# EAGLE design controller (EAGLE 9.6.2)
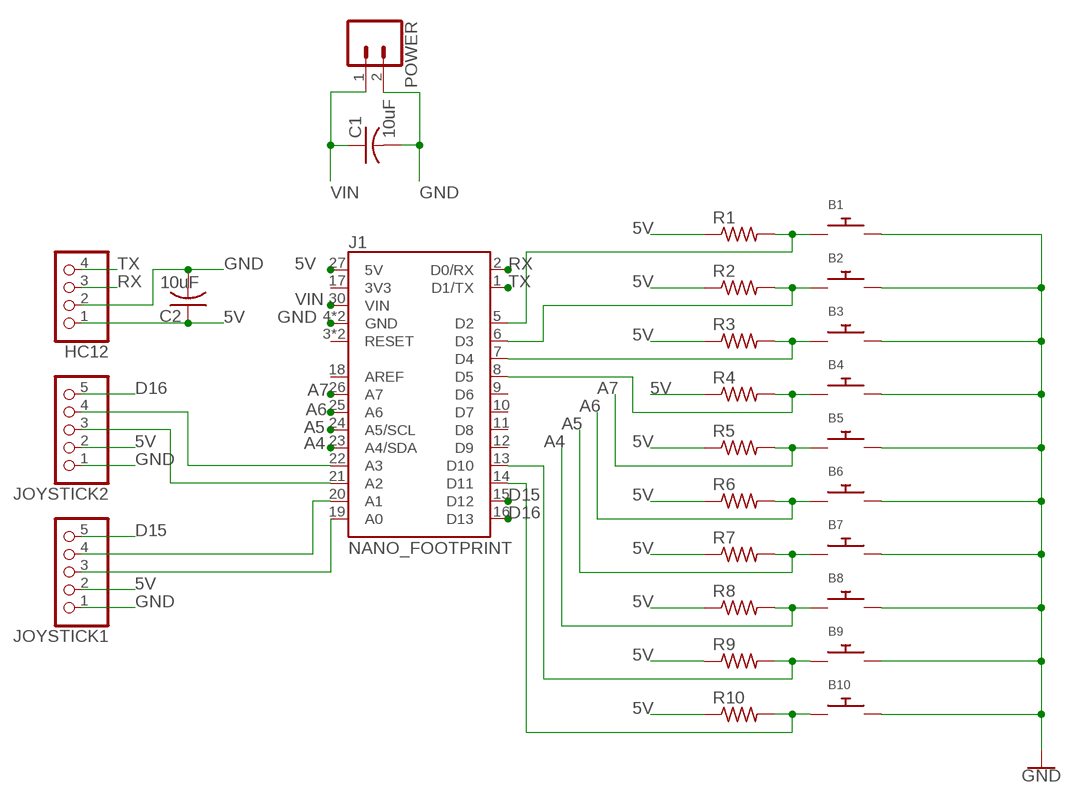
[diagram p0: schematic, sheet 1]

## Parts
B1  SWITCH_PUSHBUTTONEVQ-PE  [TACT_PANA-EVQ]
B2  SWITCH_PUSHBUTTONEVQ-PE  [TACT_PANA-EVQ]
B3  SWITCH_PUSHBUTTONEVQ-PE  [TACT_PANA-EVQ]
B4  SWITCH_PUSHBUTTONEVQ-PE  [TACT_PANA-EVQ]
B5  SWITCH_PUSHBUTTONEVQ-PE  [TACT_PANA-EVQ]
B6  SWITCH_PUSHBUTTONEVQ-PE  [TACT_PANA-EVQ]
B7  SWITCH_PUSHBUTTONEVQ-PE  [TACT_PANA-EVQ]
B8  SWITCH_PUSHBUTTONEVQ-PE  [TACT_PANA-EVQ]
B9  SWITCH_PUSHBUTTONEVQ-PE  [TACT_PANA-EVQ]
B10  SWITCH_PUSHBUTTONEVQ-PE  [TACT_PANA-EVQ]
C1  10uF  C-US025-024X044  [C025-024X044]
C2  10uF  C-US025-024X044  [C025-024X044]
HC12  PINHD-1X4  [1X04]
J1  NANO_FOOTPRINT  [NANO]
JOYSTICK1  PINHD-1X5  [1X05]
JOYSTICK2  PINHD-1X5  [1X05]
POWER  CONN_02  [1X02]
R1  R-US_0204/7  [0204/7]
R2  R-US_0204/7  [0204/7]
R3  R-US_0204/7  [0204/7]
R4  R-US_0204/7  [0204/7]
R5  R-US_0204/7  [0204/7]
R6  R-US_0204/7  [0204/7]
R7  R-US_0204/7  [0204/7]
R8  R-US_0204/7  [0204/7]
R9  R-US_0204/7  [0204/7]
R10  R-US_0204/7  [0204/7]

## Nets
5V: C2.1 HC12.1 J1.27(5V) JOYSTICK1.2 JOYSTICK2.2 R1.1 R2.1 R3.1 R4.1 R5.1 R6.1 R7.1 R8.1 R9.1 R10.1
A4: B8.P$1 J1.23(A4/SDA) R8.2
A5: B7.P$1 J1.24(A5/SCL) R7.2
A6: B6.P$1 J1.25(A6) R6.2
A7: B5.P$1 J1.26(A7) R5.2
D15: J1.15(D12) JOYSTICK1.5
D16: J1.16(D13) JOYSTICK2.5
GND: B1.P$2 B2.P$2 B3.P$2 B4.P$2 B5.P$2 B6.P$2 B7.P$2 B8.P$2 B9.P$2 B10.P$2 C1.2 C2.2 HC12.2 J1.4(GND) J1.29(GND) JOYSTICK1.1 JOYSTICK2.1 POWER.2
N$1: B1.P$1 J1.5(D2) R1.2
N$2: B2.P$1 J1.6(D3) R2.2
N$3: B3.P$1 J1.7(D4) R3.2
N$4: B4.P$1 J1.8(D5) R4.2
N$15: J1.19(A0) JOYSTICK1.3
N$16: J1.20(A1) JOYSTICK1.4
N$20: J1.21(A2) JOYSTICK2.3
N$29: B9.P$1 J1.13(D10) R9.2
N$30: B10.P$1 J1.14(D11) R10.2
N$33: J1.22(A3) JOYSTICK2.4
RX: HC12.3 J1.2(D0/RX)
TX: HC12.4 J1.1(D1/TX)
VIN: C1.1 J1.30(VIN) POWER.1
Unconnected: J1.3(RESET) J1.9(D6) J1.10(D7) J1.11(D8) J1.12(D9) J1.17(3V3) J1.18(AREF) J1.28(RESET)

## Library data of the parts
B1-B10 = adafruit:SWITCH_PUSHBUTTON: Buttons SOFTTOUCHSMD_SJ - Soft touch temporary push button (Super Junk Akihabara) Compatible with SKPMANE010 [Mouser: 688-SKPMAN] C&K_KSS = Digikey: KSS221GLFS
C1 C2 = rcl:C-US: CAPACITOR, American symbol; SPICEPREFIX: C
HC12 = pinhead:PINHD-1X4: PIN HEADER
J1 = SparkFun-Boards:NANO_FOOTPRINT: Generic Nano Footprint
JOYSTICK1 JOYSTICK2 = pinhead:PINHD-1X5: PIN HEADER
POWER = SparkFun-Connectors:CONN_02: Multi connection point. Often used as Generic Header-pin footprint for 0.1 inch spaced/style header connections On any of the 0.1 inch spaced packages, you can populate with these: Break Away Headers - Straight <https://www.sparkfun.com/products/116> (PRT-00116) Break Away Male Headers - Right Angle <https://www.sparkfun.com/products/553> (PRT-00553) Female Headers <https://www.sparkfun.com/products/115> (PRT-00115) Break Away Headers - Machine Pin <https://www.sparkfun.com/products/117> (PRT-00117) Break Away Female Headers - Swiss Machine Pin <https://www.sparkfun.com/products/743> (PRT-00743) For SCREWTERMINALS and SPRING TERMINALS visit here: Screw Terimnals on SparkFun.com <https://www.sparkfun.com/search/results?term=Screw+Terminals> (5mm/3.5mm/2.54mm spacing) This device is also useful as a general connection point to wire up your design to another part of your project. Our various solder wires solder well into these plated through hole pads. Hook-Up Wire - Assortment (Stranded, 22 AWG) <https://www.sparkfun.com/products/11375> (PRT-11375) Hook-Up Wire - Assortment (Solid Core, 22 AWG) <https://www.sparkfun.com/products/11367> (PRT-11367) View the entire wire category on our website here <https://www.sparkfun.com/categories/141> Special notes: Molex polarized connector foot print use with: PRT-08233 with associated crimp pins and housings. 2.54_SCREWTERM for use with PRT-10571. 3.5mm Screw Terminal footprints for PRT-08084 5mm Screw Terminal footprints for use with PRT-08432
R1-R10 = rcl:R-US_: RESISTOR, American symbol; SPICEPREFIX: R

## Board
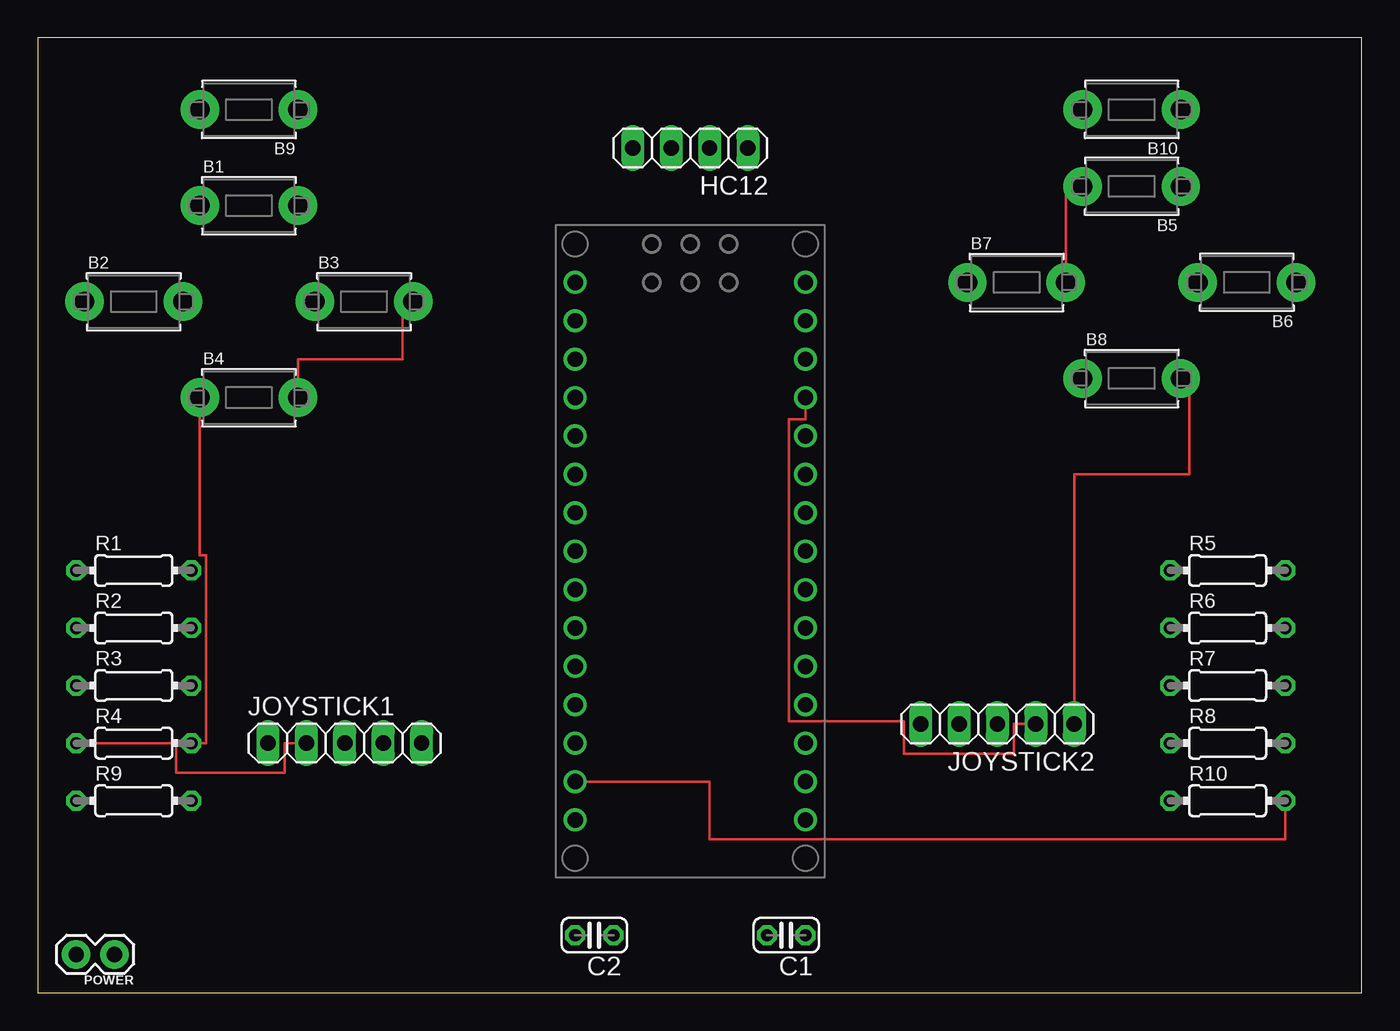
[diagram p1: board, top side]
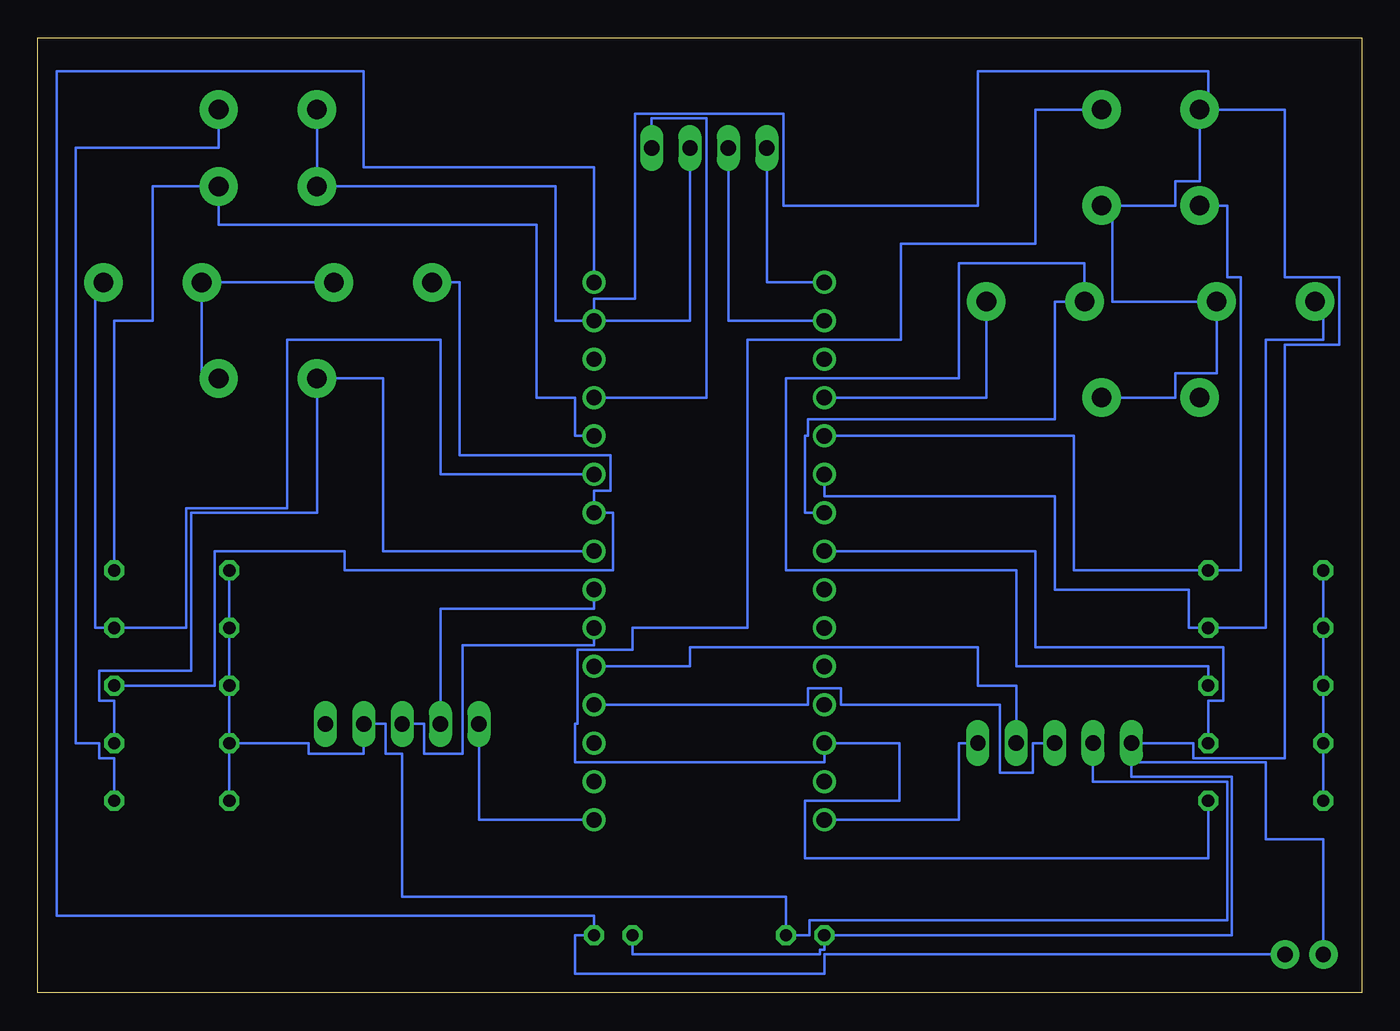
[diagram p2: board, bottom side, seen from below]

Size 87.61 x 63.17 mm. Coordinates in mm from the lower left corner, seen from the top.
Outline: 0,0 87.61,0 87.61,63.17 0,63.17 0,0
Copper layers (1*16): Top 0.035mm / dielectric 1.5mm / Bottom 0.035mm
Design rules "default": minimum track width 6mil, minimum drill 0.35mm, track to track 6mil, track to pad 6mil, pad to pad 6mil, via to via 6mil, smd to smd 6mil, copper to edge 40mil, drill to drill 6mil, minimum pad ring 10mil, minimum via ring 8mil, stop-mask expansion 4mil, vias tented up to drill 0mil, thermal gap 10mil

### Footprints (pad centres in the part's own frame; a part is rotated, then mirrored left to right if it is on the bottom)
TACT_PANA-EVQ = drill 1.3 pad 2.54: P$1 -3.25,0; P$2 3.25,0
C025-024X044 = drill 0.813 octagon: 1 -1.27,0; 2 1.27,0
1X04 = drill 1.016 long: 1 -3.81,0; 2 -1.27,0; 3 1.27,0; 4 3.81,0
NANO = drill 1.016: 1 -7.62,17.78; 2 -7.62,15.24; 3 -7.62,12.7; 4 -7.62,10.16; 5 -7.62,7.62; 6 -7.62,5.08; 7 -7.62,2.54; 8 -7.62,0; 9 -7.62,-2.54; 10 -7.62,-5.08; 11 -7.62,-7.62; 12 -7.62,-10.16; 13 -7.62,-12.7; 14 -7.62,-15.24; 15 -7.62,-17.78; 16 7.62,-17.78; 17 7.62,-15.24; 18 7.62,-12.7; 19 7.62,-10.16; 20 7.62,-7.62; 21 7.62,-5.08; 22 7.62,-2.54; 23 7.62,0; 24 7.62,2.54; 25 7.62,5.08; 26 7.62,7.62; 27 7.62,10.16; 28 7.62,12.7; 29 7.62,15.24; 30 7.62,17.78
1X05 = drill 1.016 long: 1 -5.08,0; 2 -2.54,0; 3 0,0; 4 2.54,0; 5 5.08,0
1X02 = drill 1.016 pad 1.88: 1 0,0; 2 2.54,0
0204/7 = drill 0.813 octagon: 1 -3.81,0; 2 3.81,0

### Placement (x,y rotation side)
B1  13.97,52.07 0 top
B2  6.35,45.72 0 top
B3  21.59,45.72 0 top
B4  13.97,39.37 0 top
B5  72.39,53.34 180 top
B6  80.01,46.99 180 top
B7  64.77,46.99 0 top
B8  72.39,40.64 0 top
B9  13.97,58.42 180 top
B10  72.39,58.42 180 top
C1  49.53,3.81 180 top
C2  36.83,3.81 180 top
HC12  43.18,55.88 180 top
J1  43.18,29.21 0 top
JOYSTICK1  20.32,16.51 0 top
JOYSTICK2  63.5,17.78 180 top
POWER  5.08,2.54 180 top
R1  6.35,27.94 0 top
R2  6.35,24.13 0 top
R3  6.35,20.32 0 top
R4  6.35,16.51 0 top
R5  78.74,27.94 0 top
R6  78.74,24.13 0 top
R7  78.74,20.32 0 top
R8  78.74,16.51 0 top
R9  6.35,12.7 0 top
R10  78.74,12.7 0 top

### Tracks (layer width: path | path; a pad name or v marks a point on that pad's centre or on a via)
5V
  Top 0.152: JOYSTICK1.2 16.33,16.51 16.33,14.55 9.17,14.55 9.17,16.51 R4.1 | JOYSTICK2.2 64.59,17.78 64.59,15.82 57.33,15.82 57.33,17.96 49.71,17.96 49.71,37.92 50.8,37.92 J1.27
  Bottom 0.152: R9.1 R4.1 R3.1 R2.1 R1.1 | JOYSTICK1.2 17.78,13.97 8.89,13.97 8.89,4.8 36.55,4.8 36.55,3.81 C2.1 38.1,6.35 63.5,6.35 63.5,15.82 64.59,15.82 64.59,17.78 JOYSTICK2.2 66.04,15.82 69.67,15.82 69.67,16.51 R8.1 | R10.1 R8.1 | R8.1 R7.1 R6.1 R5.1 | J1.27 43.36,39.37 43.36,57.84 46.99,57.84 HC12.1
A4
  Bottom 0.152: R8.2 82.55,19.33 83.54,19.33 83.54,21.31 77.47,21.31 77.47,31.75 69.14,31.75 B8.P$1 64.77,40.64 64.77,29.21 J1.23
A5
  Bottom 0.152: R7.2 75.92,20.32 75.92,29.21 67.31,29.21 67.31,27.94 49.53,27.94 49.53,31.75 J1.24 50.8,33.2 49.71,33.2 49.71,35.56 59.69,35.56 59.69,46.99 B7.P$1
A6
  Bottom 0.152: B6.P$1 83.82,46.99 83.82,24.13 R6.2 77.78,24.13 77.78,32.05 71.12,32.05 71.12,43.18 60.96,43.18 60.96,34.29 J1.25
A7
  Bottom 0.152: R5.2 82.55,44.45 80.01,44.45 80.01,53.34 B5.P$1 75.64,50.8 54.61,50.8 54.61,39.37 52.07,39.37 52.07,36.83 J1.26
D15
  Bottom 0.152: JOYSTICK1.5 26.67,16.51 26.67,11.43 J1.15
D16
  Bottom 0.152: JOYSTICK2.5 58.42,11.43 J1.16
GND
  Top 0.152: B4.P$2 17.22,41.91 24.13,41.91 24.13,45.72 B3.P$2 | B7.P$2 68.02,53.34 B5.P$2 | JOYSTICK2.1 68.58,34.29 76.2,34.29 76.2,40.64 B8.P$2
  Bottom 0.152: POWER.2 2.54,10.16 6.35,10.16 6.35,15.24 15.24,15.24 JOYSTICK1.1 | C1.2 48.26,2.54 35.87,2.54 35.87,2.85 35.56,2.85 C2.2 8.59,3.81 8.59,14.28 15.24,14.28 JOYSTICK1.1 | B10.P$2 B5.P$2 53.34,53.34 53.34,44.45 J1.29 | J1.29 44.45,44.45 HC12.2 | J1.29 50.8,45.9 48.08,45.9 48.08,58.14 38.28,58.14 38.28,52.07 25.4,52.07 25.4,60.96 10.16,60.96 10.16,58.42 | 10.16,58.42 B9.P$2 10.72,53.67 12.32,53.67 12.32,52.07 B1.P$2 16.51,52.07 16.51,45.72 B2.P$2 9.6,40.97 12.32,40.97 12.32,39.37 B4.P$2 | B3.P$2 24.84,39.37 J1.4 | JOYSTICK1.1 11.15,16.51 11.15,15.52 5.08,15.52 5.08,42.88 1.5,42.88 1.5,47.32 5.08,47.32 5.08,58.42 10.16,58.42 | B7.P$2 B6.P$2 76.76,40.64 B8.P$2
N$1
  Bottom 0.152: B1.P$1 8.89,52.07 8.89,47.32 8,47.32 8,27.94 R1.2 19.05,27.94 19.05,36.83 J1.5
N$2
  Bottom 0.152: B2.P$1 2.54,45.72 2.54,43.18 6.35,43.18 6.35,24.13 R2.2 11.43,24.13 11.43,26.67 20.32,26.67 20.32,32.84 35.56,32.84 J1.6
N$3
  Bottom 0.152: J1.7 36.83,31.75 36.83,36.83 36.65,36.83 36.65,37.92 20.32,37.92 20.32,45.72 B3.P$1 18.34,48.26 26.67,48.26 26.67,40.64 38.1,40.64 38.1,27.94 22.86,27.94 22.86,21.59 10.16,21.59 R3.2
N$4
  Top 0.152: B4.P$1 10.72,28.93 11.15,28.93 11.15,16.51 R4.2
  Bottom 0.152: R4.2 10.16,19.33 9.17,19.33 9.17,22.86 21.59,22.86 21.59,29.21 J1.8
N$15
  Bottom 0.152: J1.19 36.65,19.05 36.65,20.14 34.47,20.14 34.47,19.05 23.95,19.05 23.95,14.55 21.77,14.55 21.77,16.51 JOYSTICK1.3
N$16
  Bottom 0.152: JOYSTICK1.4 22.86,20.32 25.4,20.32 25.4,22.86 44.45,22.86 44.45,21.59 J1.20
N$20
  Bottom 0.152: JOYSTICK2.3 62.05,17.78 62.05,15.82 59.51,15.82 59.51,22.99 50.8,22.99 J1.21
N$29
  Bottom 0.152: R9.2 10.16,8.89 36.83,8.89 36.83,12.7 30.61,12.7 30.61,16.51 J1.13 35.56,15.24 52.07,15.24 52.07,17.78 51.89,17.78 51.89,22.68 48.26,22.68 48.26,24.13 40.64,24.13 40.64,43.18 30.48,43.18 30.48,49.53 21.59,49.53 21.59,58.42 B9.P$1
N$30
  Top 0.152: J1.14 44.45,13.97 44.45,10.16 82.55,10.16 R10.2
  Bottom 0.152: R10.2 82.55,15.52 83.54,15.52 83.54,16.51 85.09,16.51 85.09,55.88 75.64,55.88 B10.P$1
N$33
  Bottom 0.152: J1.22 50.8,25.4 60.96,25.4 JOYSTICK2.4
RX
  Bottom 0.152: HC12.3 41.91,44.45 J1.2
TX
  Bottom 0.152: HC12.4 39.37,46.99 J1.1
VIN
  Bottom 0.152: POWER.1 35.56,2.54 35.56,1.27 52.07,1.27 52.07,3.81 C1.1 50.8,5.08 86.36,5.08 86.36,60.96 66.04,60.96 66.04,54.61 50.8,54.61 J1.30